# Altium project PCB-Tester-Board-V1.PrjPcb (part 1 of 3)
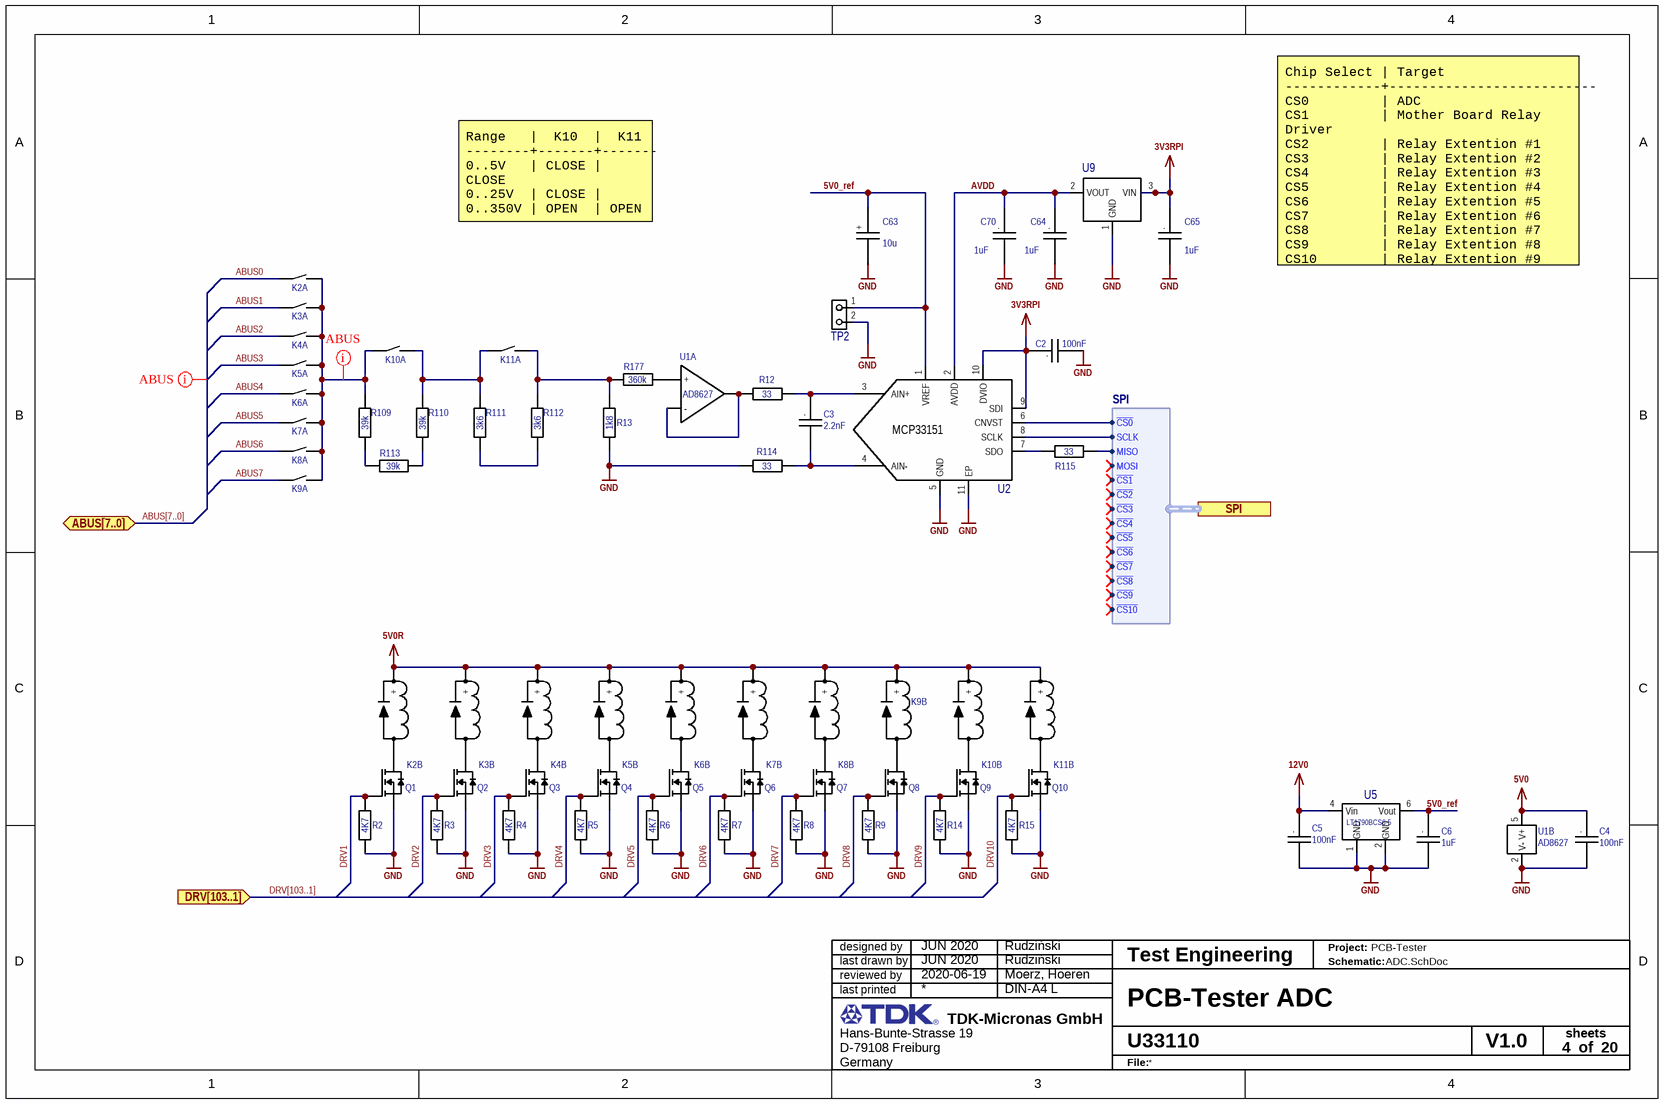
[diagram p0: ADC.SchDoc]
A_Number: A33003; Board: PCB-Tester-Board; BoardNumber: U33110; MajorRevision: 1; MinorRevision: 0; Project: PCB-Tester; Project_Name: PCB-Tester; Project_Number: U33110; Revision: 1.0; Team: Test Engineering; U_Number: U33110
10 sheets, 535 parts. Net scope: hierarchical (ports join the sheet entries above them; power ports are global).
Board file: PCB-Tester-Board-V1.PcbDoc
Sheets:
  ADC.SchDoc
  PowerRouting.SchDoc
  PSU1.SchDoc
  PSU2.SchDoc
  PSU3.SchDoc
  RelayDriver.SchDoc
  RelayExtension.SchDoc
  SignalRouting.SchDoc
  X7A15T-Decoupling.SchDoc
  AC-Cable.SchDoc

## Sheet ADC.SchDoc: PCB-Tester ADC
size A4; Date: JUN 2020; CheckedBy: Moerz, Hoeren; Author: Rudziński; CompanyName: TDK-Micronas GmbH; DrawnBy: Rudziński; Engineer: Rudziński; Organization: Test Engineering; Address1: Hans-Bunte-Strasse 19; Address2: D-79108 Freiburg; Address3: Germany; DocumentNumber: U33110; Revision: V1.0; SheetNumber: 4; SheetTotal: 20; DateDraw: JUN 2020; DateChecked: 2020-06-19; Workspace: Workspace; TitleTyp: Title-Typ; PageSetup: Record=PageOptions|CenterHorizontal=True|CenterVertical=True|PrintScale=0.97|XCorrection=1.00|YCorrection=1.00|PrintKind=0|BorderSize=5000000|LeftOffset=0|BottomOffset=0|Orientation=2|PaperLength=1000|PaperWidth=1000|Scale=100|PaperSource=7|PrintQuality=-3|MediaType=1|DitherType=10|PrintScaleMode=1|PaperKind=A4|PaperIndex=9

### Parts
C2  value 100nF  [C0402 Reflow]  (hidden comment: C)
C3  value 2.2nF  [C0603 Reflow]  (hidden comment: C)
C4  value 100nF  [C0402 Reflow]  (hidden comment: C)
C5  value 100nF  [C0402 Reflow]  (hidden comment: C)
C6  value 1uF  [C0402 Reflow]  (hidden comment: C)
C63  value 10u  [CAP_TAN_B]  (hidden comment: C+)
C64  value 1uF  [C0402 Reflow]  (hidden comment: C)
C65  value 1uF  [C0402 Reflow]  (hidden comment: C)
C70  value 1uF  [C0402 Reflow]  (hidden comment: C)
K2  K  [118-1A]  (value not drawn)  (parts A,B of 2)
K3  K  [118-1A]  (value not drawn)  (parts A,B of 2)
K4  K  [118-1A]  (value not drawn)  (parts A,B of 2)
K5  K  [118-1A]  (value not drawn)  (parts A,B of 2)
K6  K  [118-1A]  (value not drawn)  (parts A,B of 2)
K7  K  [118-1A]  (value not drawn)  (parts A,B of 2)
K8  K  [118-1A]  (value not drawn)  (parts A,B of 2)
K9  K  [118-1A]  (value not drawn)  (parts A,B of 2)
K10  K  [118-1A]  (value not drawn)  (parts A,B of 2)
K11  K  [118-1A]  (value not drawn)  (parts A,B of 2)
Q1  Q  [SOT23-3]  (value not drawn)
Q2  Q  [SOT23-3]  (value not drawn)
Q3  Q  [SOT23-3]  (value not drawn)
Q4  Q  [SOT23-3]  (value not drawn)
Q5  Q  [SOT23-3]  (value not drawn)
Q6  Q  [SOT23-3]  (value not drawn)
Q7  Q  [SOT23-3]  (value not drawn)
Q8  Q  [SOT23-3]  (value not drawn)
Q9  Q  [SOT23-3]  (value not drawn)
Q10  Q  [SOT23-3]  (value not drawn)
R2  value 4K7  [R0603 Reflow]  (hidden comment: R)
R3  value 4K7  [R0603 Reflow]  (hidden comment: R)
R4  value 4K7  [R0603 Reflow]  (hidden comment: R)
R5  value 4K7  [R0603 Reflow]  (hidden comment: R)
R6  value 4K7  [R0603 Reflow]  (hidden comment: R)
R7  value 4K7  [R0603 Reflow]  (hidden comment: R)
R8  value 4K7  [R0603 Reflow]  (hidden comment: R)
R9  value 4K7  [R0603 Reflow]  (hidden comment: R)
R12  value 33  [R0402 Reflow]  (hidden comment: R)
R13  value 1k8  [R0603 Reflow]  (hidden comment: R)
R14  value 4K7  [R0603 Reflow]  (hidden comment: R)
R15  value 4K7  [R0603 Reflow]  (hidden comment: R)
R109  value 39k  [R2512 Reflow]  (hidden comment: R)
R110  value 39k  [R2512 Reflow]  (hidden comment: R)
R111  value 3k6  [R0603 Reflow]  (hidden comment: R)
R112  value 3k6  [R0603 Reflow]  (hidden comment: R)
R113  value 39k  [R2512 Reflow]  (hidden comment: R)
R114  value 33  [R0402 Reflow]  (hidden comment: R)
R115  value 33  [R0402 Reflow]  (hidden comment: R)
R177  value 360k  [R1206 Reflow]  (hidden comment: R)
TP2  TP  [DualTestpoint 100mils]  (value not drawn)  (no BOM)
U1  U  [SC70-5]  (value not drawn)  (parts A,B of 2)
U2  NicName: MCP33151  [TDFN10EP]  (hidden comment: U)
U5  U  [TSOT23-6(S6)]  (value not drawn)
U9  U  [SOT23-3]  (value not drawn)

### Ports
ABUS[7..0] (bidir), DRV[103..1] (in), SPI (harness SPI)

### Harnesses
SPI: MISO, MOSI, SCLK, ~{CS0}, ~{CS1}, ~{CS2}, ~{CS3}, ~{CS4}, ~{CS5}, ~{CS6}, ~{CS7}, ~{CS8}, ~{CS9}, ~{CS10}

### Nets
3V3RPI: C2.1 C65.1 U2.9(SDI) U2.10(DVIO) U9.3(VIN)
5V0: C4.1 U1.5(V+)
5V0R: K2.1(+) K3.1(+) K4.1(+) K5.1(+) K6.1(+) K7.1(+) K8.1(+) K9.1(+) K10.1(+) K11.1(+)
12V0: C5.1 U5.4(Vin)
GND: C2.2 C4.2 C5.2 C6.2 C63.2 C64.2 C65.2 C70.2 Q1.2(S) Q2.2(S) Q3.2(S) Q4.2(S) Q5.2(S) Q6.2(S) Q7.2(S) Q8.2(S) Q9.2(S) Q10.2(S) R2.1 R3.1 R4.1 R5.1 R6.1 R7.1 R8.1 R9.1 R13.1 R14.1 R15.1 R114.2 TP2.2 U1.2(V-) U2.5(GND) U2.11(EP) U5.1(GND) U5.2(GND) U9.1(GND)
5V0_ref: C6.1 C63.1 TP2.1 U2.1(VREF) U5.6(Vout)  [project net 5V0_ref_4]
ABUS0: K2.4(CB)  [project net ABUS0_4]
ABUS1: K3.4(CB)  [project net ABUS1_4]
ABUS2: K4.4(CB)  [project net ABUS2_4]
ABUS3: K5.4(CB)  [project net ABUS3_4]
ABUS4: K6.4(CB)  [project net ABUS4_4]
ABUS5: K7.4(CB)  [project net ABUS5_4]
ABUS6: K8.4(CB)  [project net ABUS6_4]
ABUS7: K9.4(CB)  [project net ABUS7_4]
AVDD: C64.1 C70.1 U2.2(AVDD) U9.2(VOUT)  [project net AVDD_4]
DRV1: Q1.1(G) R2.2  [project net DRV1_4]
DRV2: Q2.1(G) R3.2  [project net DRV2_4]
DRV3: Q3.1(G) R4.2  [project net DRV3_4]
DRV4: Q4.1(G) R5.2  [project net DRV4_4]
DRV5: Q5.1(G) R6.2  [project net DRV5_4]
DRV6: Q6.1(G) R7.2  [project net DRV6_4]
DRV7: Q7.1(G) R8.2  [project net DRV7_4]
DRV8: Q8.1(G) R9.2  [project net DRV8_4]
DRV9: Q9.1(G) R14.2  [project net DRV9_4]
DRV10: Q10.1(G) R15.2  [project net DRV10_4]
NetC3_1: C3.1 R12.1 U2.3(AIN+)
NetC3_2: C3.2 R114.1 U2.4(AIN-)
NetK2_2: K2.2(-) Q1.3(D)
NetK2_3: K2.3(CA) K3.3(CA) K4.3(CA) K5.3(CA) K6.3(CA) K7.3(CA) K8.3(CA) K9.3(CA) K10.4(CB) R109.2
NetK3_2: K3.2(-) Q2.3(D)
NetK4_2: K4.2(-) Q3.3(D)
NetK5_2: K5.2(-) Q4.3(D)
NetK6_2: K6.2(-) Q5.3(D)
NetK7_2: K7.2(-) Q6.3(D)
NetK8_2: K8.2(-) Q7.3(D)
NetK9_2: K9.2(-) Q8.3(D)
NetK10_2: K10.2(-) Q9.3(D)
NetK10_3: K10.3(CA) K11.4(CB) R110.2 R111.2
NetK11_2: K11.2(-) Q10.3(D)
NetK11_3: K11.3(CA) R13.2 R112.2 R177.2
NetR12_2: R12.2 U1.1(Out) U1.4(-)
NetR109_1: R109.1 R113.2
NetR110_1: R110.1 R113.1
NetR111_1: R111.1 R112.1
NetR115_1: R115.1 U2.7(SDO)
NetR115_2: R115.2 ; port SPI.MISO
NetR177_1: R177.1 U1.3(+)
NetU2_6: U2.6(CNVST) ; port SPI.~{CS0}
NetU2_8: U2.8(SCLK) ; port SPI.SCLK

### Buses and harness runs
bus ABUS[7..0] = port ABUS[7..0]
bus DRV[103..1] = port DRV[103..1]

### Layout directives
net class ABUS: (no net found under the mark), NetK2_3

### Notes on the sheet
- Range   |  K10  |  K11
  --------+-------+-------
  0..5V   | CLOSE | CLOSE
  0..25V  | CLOSE |
  0..350V | OPEN  | OPEN
- Chip Select | Target
  ------------+--------------------------
  CS0         | ADC
  CS1         | Mother Board Relay Driver
  CS2         | Relay Extention #1
  CS3         | Relay Extention #2
  CS4         | Relay Extention #3
  CS5         | Relay Extention #4
  CS6         | Relay Extention #5
  CS7         | Relay Extention #6
  CS8         | Relay Extention #7
  CS9         | Relay Extention #8
  CS10        | Relay Extention #9
- designed by
- reviewed by
- last drawn by
- Project:
- Schematic:
- last printed
- DIN-A4 L
- sheets
- of
- File:
- (in symbol C) .
- (in symbol C+_TAN) +

### Library data of the parts
C2 C4 C5 = C: CAP CER 0.1UF 25V X7R 0402; 04. Manufacturer: Yageo; 07. Manufacturer  Part Number: CC0402KRX7R8BB104; Tolerance: ±5%; Voltage Rating: 16V; 03. Unit Price: 0.09; 13. Created Date/Name: AUG2018/Hören; Type: X7R; ComponentLink1Description: Info; ComponentLink1URL: https://www.digikey.de/product-detail/en/kemet/C0402C104J4RACTU/399-7761-6-ND/3472292; 02. Distributor Part Number: 311-2077-6-ND; 09. Operating Temperature: -55°C ~ 125°C; 11. RoHS: YES; 01. Distributor: DigiKey; ComponentLink2Description: DataSheet; ComponentLink2URL: https://content.kemet.com/datasheets/KEM_C1002_X7R_SMD.pdf; Package: 0402
C3 = C: CAP CER 2200PF 50V X7R 0402; 04. Manufacturer: Samsung Electro-Mechanics; 07. Manufacturer  Part Number: CL05B222JB5NNNC; Tolerance: ±5%; 03. Unit Price: 0.09; 13. Created Date/Name: AUG2018/Hören; Voltage Rating: 50V; Type: X7R; ComponentLink1Description: Info; ComponentLink1URL: https://www.digikey.de/product-detail/en/samsung-electro-mechanics/CL05B222JB5NNNC/1276-1532-6-ND/3892046; 02. Distributor Part Number: 1276-1532-6-ND; 09. Operating Temperature: -55°C ~ 125°C; 11. RoHS: YES; 01. Distributor: DigiKey; ComponentLink2Description: DataSheet; Package: 0402
C6 C64 C65 C70 = C: CAP CER 1UF 6.3V X7R 0402; 04. Manufacturer: Murata Electronics; 07. Manufacturer  Part Number: GRM155R70J105KA12J; Tolerance: ±10%; 03. Unit Price: 0.11; 13. Created Date/Name: AUG2018/Hören; Voltage Rating: 6.3V; Type: X7R; ComponentLink1Description: Info; ComponentLink1URL: https://www.digikey.de/product-detail/en/murata-electronics/GRM155R70J105KA12J/490-13339-6-ND/5973468; 02. Distributor Part Number: 490-13339-6-ND; 09. Operating Temperature: -55°C ~ 125°C; 11. RoHS: YES; 01. Distributor: DigiKey; ComponentLink2Description: DataSheet; Package: 0402
C63 = C+_TAN: CAP TANT 10UF 20% 16V 1411; 04. Manufacturer: Vishay Sprague; 07. Manufacturer  Part Number: TMCHB1C106MTRF; 03. Unit Price: 0.4; 3D-Export: No; ComponentLink1Description: Info; 02. Distributor Part Number: 718-2344-1-ND; 11. RoHS: YES; 01. Distributor: DigiKey; ComponentLink2Description: DataSheet
K2-K11 = 118-1-A-5/2D: 5V Signal Relais, Normal Open; 04. Manufacturer: Pickering; 03. Unit Price: 2.60; 05. Quantity: 1000; 06. Data Sheet: Pickering_series_118.pdf; 13. Created Date/Name: 20.12.17 S. Kaiser; Coil Resistance: 1500 Ohm; Max Carry Current: 1.2 A; Max Switch Current: 1A; Max Switch Voltage: 200V; Power Rating: 15W; 01. Distributor: Pickering; 02. Distributor Part Number: 118-1-A-5/2D; 07. Manufacturer  Part Number: 118-1-A-5/2D; 09. Operating Temperature: -20°C ~ +85°C; 11. RoHS: 2011/65/EU; ComponentLink1Description: Info; ComponentLink1URL: http://www.pickeringrelay.com/; ComponentLink2Description: DataSheet; ComponentLink2URL: https://www.pickeringrelay.com/products/single-line-sil-series-111-119/single-line-sil-series-118/; Coil Voltage: 5V
Q1-Q10 = FDV303N: MOSFET N-CH 25V 680MA SOT-23; 04. Manufacturer: ON Semiconductor; 03. Unit Price: 0.41; 13. Created Date/Name: AUG 2018 / Hören; Rds On: 450 mΩ @ id=500mA & Vgs=4.5V; Vgs,th: 1.5V @ 250uA; Power Rating: 350mW; 3D-Export: No; 01. Distributor: DigiKey; 02. Distributor Part Number: FDV303NDKR-ND; 07. Manufacturer  Part Number: FDV303N; 09. Operating Temperature: -55°C ~ 150°C (TJ); 11. RoHS: YES; ComponentLink1Description: Info; ComponentLink1URL: https://www.digikey.de/product-detail/en/on-semiconductor/FDV303N/FDV303NDKR-ND/1630434; ComponentLink2Description: DataSheet; ComponentLink2URL: https://media.digikey.com/pdf/Data%20Sheets/Fairchild%20PDFs/FDV303N.pdf; Vdss: 25V; Id: 680mA
R2-R9 R14 R15 = R: RES SMD 4.7K OHM 1% 1/10W 0603; 04. Manufacturer: Yageo; 07. Manufacturer  Part Number: RC0603FR-074K7L; 03. Unit Price: 0.09; 13. Created Date/Name: AUG2018/Hören; Tolerance: ±1%; ComponentLink1URL: *; ComponentLink1Description: Info; 02. Distributor Part Number: 311-4.70KHRCT-ND; 09. Operating Temperature: -xx..+yy°C; 11. RoHS: ???; 01. Distributor: DigiKey; ComponentLink2Description: DataSheet; Package: *
R12 R114 = R: RES SMD 33 OHM 1% 1/16W 0402; 04. Manufacturer: Yageo; 07. Manufacturer  Part Number: RC0402FR-0733RL; 03. Unit Price: 0.09; 13. Created Date/Name: AUG2018/Hören; Power Rating: 0.1W; Tolerance: ±1%; ComponentLink1URL: https://www.digikey.de/product-detail/en/panasonic-electronic-components/ERJ-2RKF15R0X/P15.0LDKR-ND/575530; ComponentLink1Description: Info; 02. Distributor Part Number: 311-33.0LRDKR-ND; 09. Operating Temperature: -55°C ~ 155°C; 11. RoHS: YES; 01. Distributor: DigiKey; ComponentLink2Description: DataSheet; ComponentLink2URL: https://industrial.panasonic.com/cdbs/www-data/pdf/RDA0000/AOA0000C304.pdf; Type: Thick Film; Package: 0402
R13 = R: RES SMD 1.8K OHM 1% 1/16W 0402; 04. Manufacturer: Yageo; 07. Manufacturer  Part Number: RC0402FR-071K8L; 03. Unit Price: 0.09; 13. Created Date/Name: AUG2018/Hören; Tolerance: ±1%; ComponentLink1URL: *; ComponentLink1Description: Info; 02. Distributor Part Number: 311-1.80KLRCT-ND; 09. Operating Temperature: -xx..+yy°C; 11. RoHS: ???; 01. Distributor: DigiKey; ComponentLink2Description: DataSheet; Package: *
R109 R110 R113 = R: CRGP 2512 39K 1%; 04. Manufacturer: TE Connectivity Passive Product; 07. Manufacturer  Part Number: CRGP2512F39K; 03. Unit Price: 0.44; 13. Created Date/Name: AUG2018/Hören; Tolerance: ±1%; ComponentLink1URL: *; ComponentLink1Description: Info; 02. Distributor Part Number: A130740CT-ND; 09. Operating Temperature: -xx..+yy°C; 11. RoHS: ???; 01. Distributor: DigiKey; ComponentLink2Description: DataSheet; Package: *
R111 R112 = R: RES SMD 3.6K OHM 1% 1/10W 0603; 04. Manufacturer: Yageo; 07. Manufacturer  Part Number: RC0603FR-073K6L; 03. Unit Price: 0.09; 13. Created Date/Name: AUG2018/Hören; Tolerance: ±1%; ComponentLink1URL: *; ComponentLink1Description: Info; 02. Distributor Part Number: 311-3.60KHRCT-ND; 09. Operating Temperature: -xx..+yy°C; 11. RoHS: ???; 01. Distributor: DigiKey; ComponentLink2Description: DataSheet; Package: *
R115 = R_19: RES SMD 33 OHM 1% 1/16W 0402; 04. Manufacturer: Yageo; 07. Manufacturer  Part Number: RC0402FR-0733RL; 03. Unit Price: 0.09; 13. Created Date/Name: AUG2018/Hören; Power Rating: 63mW; Tolerance: ±1%; ComponentLink1URL: https://www.digikey.de/products/en?keywords=311-33.0LRDKR-ND; ComponentLink1Description: Info; 02. Distributor Part Number: 311-33.0LRDKR-ND; 09. Operating Temperature: -55°C ~ 155°C; 11. RoHS: YES; 01. Distributor: DigiKey; ComponentLink2Description: DataSheet; Type: Thick Film; Package: 0402
R177 = R: RES SMD 360K OHM 1% 1/4W 1206; 04. Manufacturer: Yageo; 07. Manufacturer  Part Number: RC1206FR-07360KL; 03. Unit Price: 0.09; 13. Created Date/Name: AUG2018/Hören; Tolerance: ±1%; ComponentLink1URL: *; ComponentLink1Description: Info; 02. Distributor Part Number: 311-360KFRCT-ND; 09. Operating Temperature: -xx..+yy°C; 11. RoHS: ???; 01. Distributor: DigiKey; ComponentLink2Description: DataSheet; Package: *
TP2 = DualTestpoint 100mils: Dual testpoint, pitch 2.54mm; 04. Manufacturer: Samtec Inc.; 07. Manufacturer  Part Number: HMTSW-103-07-G-S-240; 03. Unit Price: 0.25; 13. Created Date/Name: AUG2018/Hören; 01. Distributor: Samtec Inc.; 02. Distributor Part Number: HMTSW-103-07-G-S-240; 11. RoHS: YES; ComponentLink1Description: Info; ComponentLink1URL: https://www.samtec.com/products/hmtsw-103-07-g-s-240; ComponentLink2Description: DataSheet; ComponentLink2URL: http://suddendocs.samtec.com/catalog_english/hmtsw.pdf
U1 = AD8627: IC OPAMP JFET 5MHZ RRO SC70-5; 04. Manufacturer: Analog Devices Inc.; 07. Manufacturer  Part Number: AD8627AKSZ-R2; 03. Unit Price: 5.15; 13. Created Date/Name: AUG 2018 / Hören; 01. Distributor: DigiKey; 02. Distributor Part Number: AD8627AKSZ-R2DKR-ND; 09. Operating Temperature: -40°C ~ 85°C; 11. RoHS: YES; ComponentLink1Description: Info; ComponentLink1URL: https://www.digikey.de/product-detail/en/analog-devices-inc/AD8627AKSZ-R2/AD8627AKSZ-R2DKR-ND/3878640; ComponentLink2Description: DataSheet; ComponentLink2URL: http://www.analog.com/media/en/technical-documentation/data-sheets/AD8625_8626_8627.pdf; Package: SC70-5; Part: AD8627
U2 = MCP33151-10T-E/MN: 14-BIT 1 MSPS SGL CH SGL-ENDED S; 04. Manufacturer: Microchip Technology; 03. Unit Price: 4.5; 13. Created Date/Name: AUG 2018 / Hören; 01. Distributor: DigiKey; 02. Distributor Part Number: MCP33151-10T-E/MNDKR-ND; 07. Manufacturer  Part Number: MCP33151-10T-E/MN; 11. RoHS: YES; ComponentLink1Description: Info; ComponentLink1URL: https://www.digikey.de/product-detail/en/microchip-technology/MCP33151-10T-E-MN/MCP33151-10T-E-MNDKR-ND/10270414; ComponentLink2Description: DataSheet; ComponentLink2URL: http://ww1.microchip.com/downloads/en/DeviceDoc/MCP33151-XX-Family-Data-Sheet-DS20006220A.pdf; Package: 10-WFDFN Exposed Pad
U5 = LT1790BCS6-5: IC VREF SERIES 5V, 0.1% TSOT-23-6; 04. Manufacturer: Linear Technology/Analog Devices; 07. Manufacturer  Part Number: LT1790BCS6-5#TRMPBF; 03. Unit Price: 2.86; 13. Created Date/Name: AUG 2018 / Hören; 01. Distributor: DigiKey; 02. Distributor Part Number: LT1790BCS6-5#TRMPBFDKR-ND; 09. Operating Temperature: 0°C ~ 70°C (TA); 11. RoHS: YES; ComponentLink1Description: Info; ComponentLink1URL: https://www.digikey.de/product-detail/en/linear-technology-analog-devices/LT1790BCS6-5-TRMPBF/LT1790BCS6-5-TRMPBFDKR-ND/1618066; ComponentLink2Description: DataSheet; ComponentLink2URL: https://www.analog.com/media/en/technical-documentation/data-sheets/1790fc.pdf; NicName: LT1790BCS6-5
U9 = AP2138N: IC REG LINEAR 1.8V 250MA SOT23-3; 04. Manufacturer: Diodes Incorporated; 07. Manufacturer  Part Number: AP2138N-1.8TRG1; 03. Unit Price: 0.43; 01. Distributor: DigiKey; 02. Distributor Part Number: AP2138N-1.8TRG1DICT-ND; 11. RoHS: YES; ComponentLink1Description: Info; ComponentLink2Description: DataSheet

## Sheet PowerRouting.SchDoc: PCB-Tester Power Routing
size A4; Date: JUN 2020; CheckedBy: Moerz, Hoeren; Author: Rudziński; CompanyName: TDK-Micronas GmbH; DrawnBy: Rudziński; Engineer: Rudziński; Organization: Test Engineering; Address1: Hans-Bunte-Strasse 19; Address2: D-79108 Freiburg; Address3: Germany; DocumentNumber: U33110; Revision: V1.0; SheetNumber: 18; SheetTotal: 20; DateDraw: JUN 2020; DateChecked: 2020-06-19; Workspace: Workspace; TitleTyp: Title-Typ; PageSetup: Record=PageOptions|CenterHorizontal=True|CenterVertical=True|PrintScale=0.97|XCorrection=1.00|YCorrection=1.00|PrintKind=0|BorderSize=5000000|LeftOffset=0|BottomOffset=0|Orientation=2|PaperLength=1000|PaperWidth=1000|Scale=100|PaperSource=7|PrintQuality=-3|MediaType=1|DitherType=10|PrintScaleMode=1|PaperKind=A4|PaperIndex=9
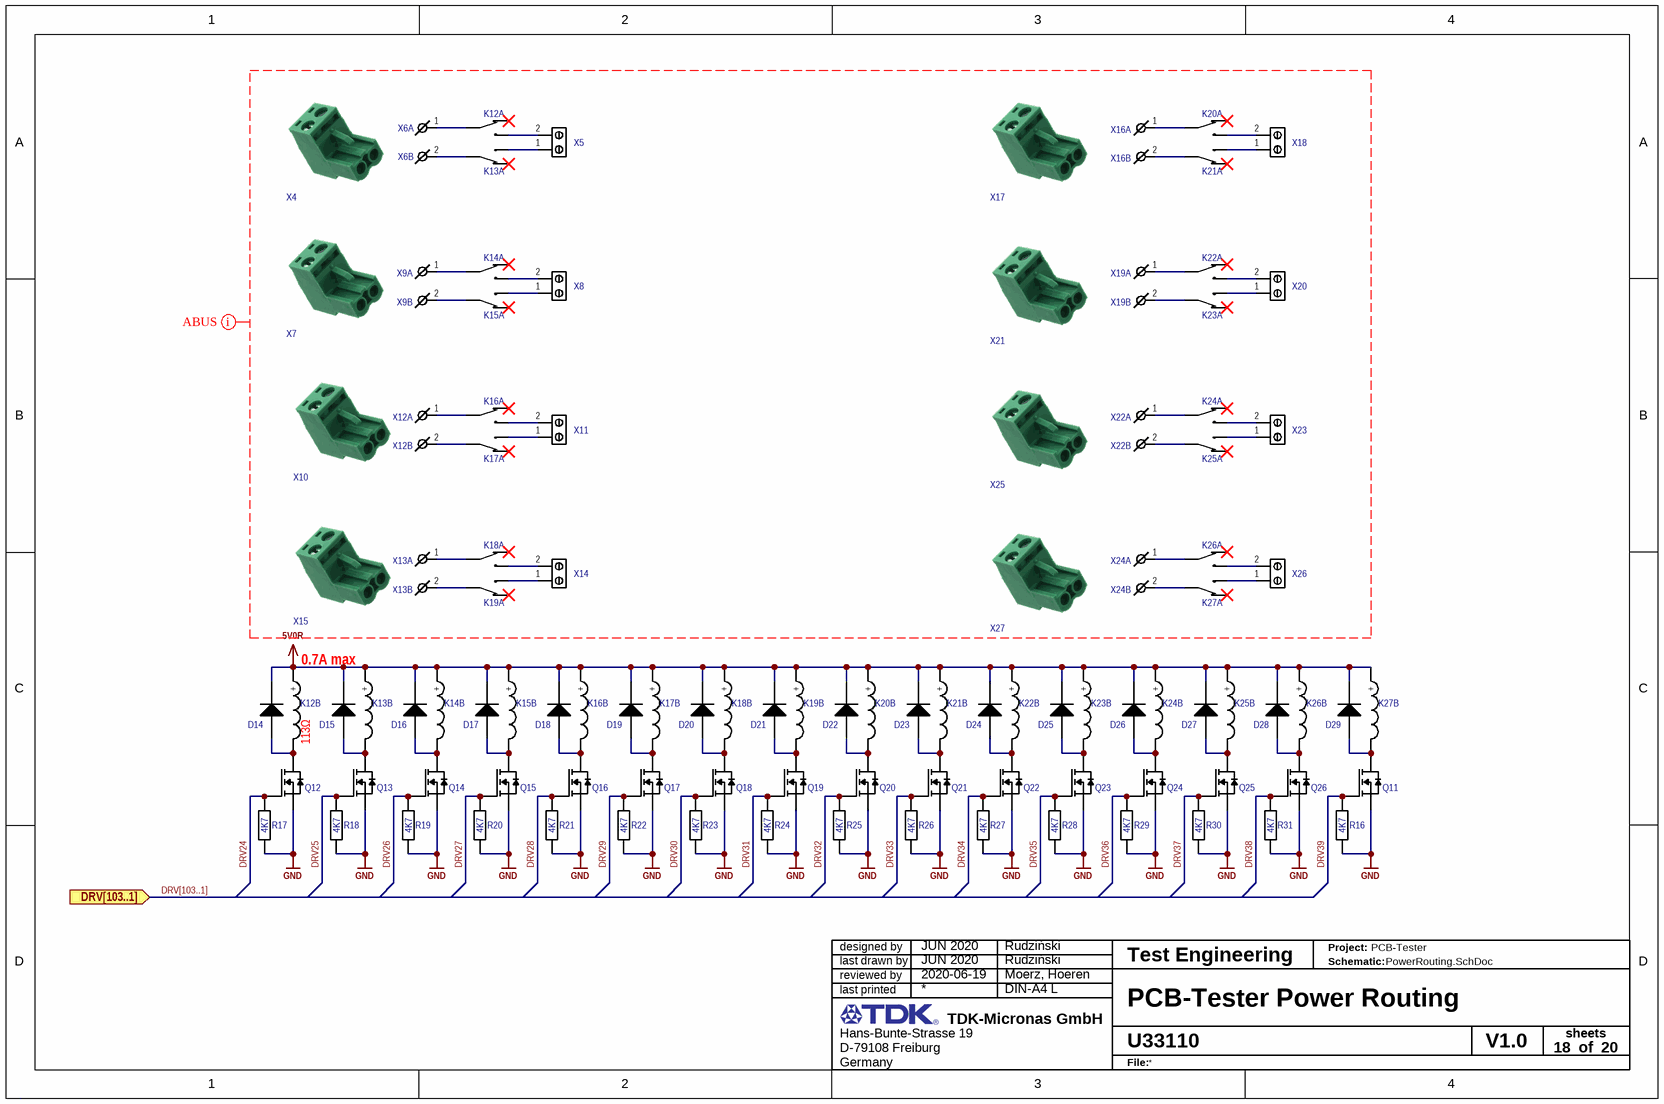
[diagram p1: PowerRouting.SchDoc]

### Parts
D14  D  [SOD123]  (value not drawn)
D15  D  [SOD123]  (value not drawn)
D16  D  [SOD123]  (value not drawn)
D17  D  [SOD123]  (value not drawn)
D18  D  [SOD123]  (value not drawn)
D19  D  [SOD123]  (value not drawn)
D20  D  [SOD123]  (value not drawn)
D21  D  [SOD123]  (value not drawn)
D22  D  [SOD123]  (value not drawn)
D23  D  [SOD123]  (value not drawn)
D24  D  [SOD123]  (value not drawn)
D25  D  [SOD123]  (value not drawn)
D26  D  [SOD123]  (value not drawn)
D27  D  [SOD123]  (value not drawn)
D28  D  [SOD123]  (value not drawn)
D29  D  [SOD123]  (value not drawn)
K12  K  [HF118F005-1ZS1]  (value not drawn)  (parts A,B of 2)
K13  K  [HF118F005-1ZS1]  (value not drawn)  (parts A,B of 2)
K14  K  [HF118F005-1ZS1]  (value not drawn)  (parts A,B of 2)
K15  K  [HF118F005-1ZS1]  (value not drawn)  (parts A,B of 2)
K16  K  [HF118F005-1ZS1]  (value not drawn)  (parts A,B of 2)
K17  K  [HF118F005-1ZS1]  (value not drawn)  (parts A,B of 2)
K18  K  [HF118F005-1ZS1]  (value not drawn)  (parts A,B of 2)
K19  K  [HF118F005-1ZS1]  (value not drawn)  (parts A,B of 2)
K20  K  [HF118F005-1ZS1]  (value not drawn)  (parts A,B of 2)
K21  K  [HF118F005-1ZS1]  (value not drawn)  (parts A,B of 2)
K22  K  [HF118F005-1ZS1]  (value not drawn)  (parts A,B of 2)
K23  K  [HF118F005-1ZS1]  (value not drawn)  (parts A,B of 2)
K24  K  [HF118F005-1ZS1]  (value not drawn)  (parts A,B of 2)
K25  K  [HF118F005-1ZS1]  (value not drawn)  (parts A,B of 2)
K26  K  [HF118F005-1ZS1]  (value not drawn)  (parts A,B of 2)
K27  K  [HF118F005-1ZS1]  (value not drawn)  (parts A,B of 2)
Q11  Q  [SOT23-3]  (value not drawn)
Q12  Q  [SOT23-3]  (value not drawn)
Q13  Q  [SOT23-3]  (value not drawn)
Q14  Q  [SOT23-3]  (value not drawn)
Q15  Q  [SOT23-3]  (value not drawn)
Q16  Q  [SOT23-3]  (value not drawn)
Q17  Q  [SOT23-3]  (value not drawn)
Q18  Q  [SOT23-3]  (value not drawn)
Q19  Q  [SOT23-3]  (value not drawn)
Q20  Q  [SOT23-3]  (value not drawn)
Q21  Q  [SOT23-3]  (value not drawn)
Q22  Q  [SOT23-3]  (value not drawn)
Q23  Q  [SOT23-3]  (value not drawn)
Q24  Q  [SOT23-3]  (value not drawn)
Q25  Q  [SOT23-3]  (value not drawn)
Q26  Q  [SOT23-3]  (value not drawn)
R16  value 4K7  [R0603 Reflow]  (hidden comment: R)
R17  value 4K7  [R0603 Reflow]  (hidden comment: R)
R18  value 4K7  [R0603 Reflow]  (hidden comment: R)
R19  value 4K7  [R0603 Reflow]  (hidden comment: R)
R20  value 4K7  [R0603 Reflow]  (hidden comment: R)
R21  value 4K7  [R0603 Reflow]  (hidden comment: R)
R22  value 4K7  [R0603 Reflow]  (hidden comment: R)
R23  value 4K7  [R0603 Reflow]  (hidden comment: R)
R24  value 4K7  [R0603 Reflow]  (hidden comment: R)
R25  value 4K7  [R0603 Reflow]  (hidden comment: R)
R26  value 4K7  [R0603 Reflow]  (hidden comment: R)
R27  value 4K7  [R0603 Reflow]  (hidden comment: R)
R28  value 4K7  [R0603 Reflow]  (hidden comment: R)
R29  value 4K7  [R0603 Reflow]  (hidden comment: R)
R30  value 4K7  [R0603 Reflow]  (hidden comment: R)
R31  value 4K7  [R0603 Reflow]  (hidden comment: R)
X4  X  [691352710002]  (value not drawn)
X5  X  [1731721]  (value not drawn)
X6  X  [691312710002]  (value not drawn)  (parts A,B of 2)
X7  X  [691352710002]  (value not drawn)
X8  X  [1731721]  (value not drawn)
X9  X  [691312710002]  (value not drawn)  (parts A,B of 2)
X10  X  [691352710002]  (value not drawn)
X11  X  [1731721]  (value not drawn)
X12  X  [691312710002]  (value not drawn)  (parts A,B of 2)
X13  X  [691312710002]  (value not drawn)  (parts A,B of 2)
X14  X  [1731721]  (value not drawn)
X15  X  [691352710002]  (value not drawn)
X16  X  [691312710002]  (value not drawn)  (parts A,B of 2)
X17  X  [691352710002]  (value not drawn)
X18  X  [1731721]  (value not drawn)
X19  X  [691312710002]  (value not drawn)  (parts A,B of 2)
X20  X  [1731721]  (value not drawn)
X21  X  [691352710002]  (value not drawn)
X22  X  [691312710002]  (value not drawn)  (parts A,B of 2)
X23  X  [1731721]  (value not drawn)
X24  X  [691312710002]  (value not drawn)  (parts A,B of 2)
X25  X  [691352710002]  (value not drawn)
X26  X  [1731721]  (value not drawn)
X27  X  [691352710002]  (value not drawn)

### Ports
DRV[103..1] (in)

### Nets
5V0R: D14.2(C) D15.2(C) D16.2(C) D17.2(C) D18.2(C) D19.2(C) D20.2(C) D21.2(C) D22.2(C) D23.2(C) D24.2(C) D25.2(C) D26.2(C) D27.2(C) D28.2(C) D29.2(C) K12.1(+) K13.1(+) K14.1(+) K15.1(+) K16.1(+) K17.1(+) K18.1(+) K19.1(+) K20.1(+) K21.1(+) K22.1(+) K23.1(+) K24.1(+) K25.1(+) K26.1(+) K27.1(+)
GND: Q11.2(S) Q12.2(S) Q13.2(S) Q14.2(S) Q15.2(S) Q16.2(S) Q17.2(S) Q18.2(S) Q19.2(S) Q20.2(S) Q21.2(S) Q22.2(S) Q23.2(S) Q24.2(S) Q25.2(S) Q26.2(S) R16.1 R17.1 R18.1 R19.1 R20.1 R21.1 R22.1 R23.1 R24.1 R25.1 R26.1 R27.1 R28.1 R29.1 R30.1 R31.1
DRV24: Q12.1(G) R17.2  [project net DRV24_18]
DRV25: Q13.1(G) R18.2  [project net DRV25_18]
DRV26: Q14.1(G) R19.2  [project net DRV26_18]
DRV27: Q15.1(G) R20.2  [project net DRV27_18]
DRV28: Q16.1(G) R21.2  [project net DRV28_18]
DRV29: Q17.1(G) R22.2  [project net DRV29_18]
DRV30: Q18.1(G) R23.2  [project net DRV30_18]
DRV31: Q19.1(G) R24.2  [project net DRV31_18]
DRV32: Q20.1(G) R25.2  [project net DRV32_18]
DRV33: Q21.1(G) R26.2  [project net DRV33_18]
DRV34: Q22.1(G) R27.2  [project net DRV34_18]
DRV35: Q23.1(G) R28.2  [project net DRV35_18]
DRV36: Q24.1(G) R29.2  [project net DRV36_18]
DRV37: Q25.1(G) R30.2  [project net DRV37_18]
DRV38: Q26.1(G) R31.2  [project net DRV38_18]
DRV39: Q11.1(G) R16.2  [project net DRV39_18]
NetD14_1: D14.1(A) K12.5(-) Q12.3(D)
NetD15_1: D15.1(A) K13.5(-) Q13.3(D)
NetD16_1: D16.1(A) K14.5(-) Q14.3(D)
NetD17_1: D17.1(A) K15.5(-) Q15.3(D)
NetD18_1: D18.1(A) K16.5(-) Q16.3(D)
NetD19_1: D19.1(A) K17.5(-) Q17.3(D)
NetD20_1: D20.1(A) K18.5(-) Q18.3(D)
NetD21_1: D21.1(A) K19.5(-) Q19.3(D)
NetD22_1: D22.1(A) K20.5(-) Q20.3(D)
NetD23_1: D23.1(A) K21.5(-) Q21.3(D)
NetD24_1: D24.1(A) K22.5(-) Q22.3(D)
NetD25_1: D25.1(A) K23.5(-) Q23.3(D)
NetD26_1: D26.1(A) K24.5(-) Q24.3(D)
NetD27_1: D27.1(A) K25.5(-) Q25.3(D)
NetD28_1: D28.1(A) K26.5(-) Q26.3(D)
NetD29_1: D29.1(A) K27.5(-) Q11.3(D)
NetK12_2: K12.2(Cin) X6.1(+)
NetK12_3: K12.3(Cno) X5.2
NetK13_2: K13.2(Cin) X6.2(-)
NetK13_3: K13.3(Cno) X5.1
NetK14_2: K14.2(Cin) X9.1(+)
NetK14_3: K14.3(Cno) X8.2
NetK15_2: K15.2(Cin) X9.2(-)
NetK15_3: K15.3(Cno) X8.1
NetK16_2: K16.2(Cin) X12.1(+)
NetK16_3: K16.3(Cno) X11.2
NetK17_2: K17.2(Cin) X12.2(-)
NetK17_3: K17.3(Cno) X11.1
NetK18_2: K18.2(Cin) X13.1(+)
NetK18_3: K18.3(Cno) X14.2
NetK19_2: K19.2(Cin) X13.2(-)
NetK19_3: K19.3(Cno) X14.1
NetK20_2: K20.2(Cin) X16.1(+)
NetK20_3: K20.3(Cno) X18.2
NetK21_2: K21.2(Cin) X16.2(-)
NetK21_3: K21.3(Cno) X18.1
NetK22_2: K22.2(Cin) X19.1(+)
NetK22_3: K22.3(Cno) X20.2
NetK23_2: K23.2(Cin) X19.2(-)
NetK23_3: K23.3(Cno) X20.1
NetK24_2: K24.2(Cin) X22.1(+)
NetK24_3: K24.3(Cno) X23.2
NetK25_2: K25.2(Cin) X22.2(-)
NetK25_3: K25.3(Cno) X23.1
NetK26_2: K26.2(Cin) X24.1(+)
NetK26_3: K26.3(Cno) X26.2
NetK27_2: K27.2(Cin) X24.2(-)
NetK27_3: K27.3(Cno) X26.1

Not connected (* = marked no-connect by the designer): K12 4(Cnc)*; K13 4(Cnc)*; K14 4(Cnc)*; K15 4(Cnc)*; K16 4(Cnc)*; K17 4(Cnc)*; K18 4(Cnc)*; K19 4(Cnc)*; K20 4(Cnc)*; K21 4(Cnc)*; K22 4(Cnc)*; K23 4(Cnc)*; K24 4(Cnc)*; K25 4(Cnc)*; K26 4(Cnc)*; K27 4(Cnc)*

### Buses and harness runs
bus DRV[103..1] = port DRV[103..1]

### Layout directives
net class ABUS: (no net found under the mark)

### Notes on the sheet
- 0.7A max
- designed by
- reviewed by
- last drawn by
- Project:
- Schematic:
- last printed
- DIN-A4 L
- sheets
- of
- File:

### Library data of the parts
D14-D29 = 1N4148W: DIODE GEN PURP 100V 300MA SOD123; 04. Manufacturer: Diodes Incorporated; 07. Manufacturer  Part Number: 1N4148W-7-F; 03. Unit Price: 0.14; 01. Distributor: DigiKey; 02. Distributor Part Number: 1N4148W-FDICT-ND; 11. RoHS: YES; ComponentLink1Description: Info; ComponentLink1URL: https://www.digikey.de/product-detail/en/nexperia-usa-inc/PMEG4050EP115/1727-5842-6-ND/2697559; ComponentLink2Description: DataSheet; ComponentLink2URL: https://assets.nexperia.com/documents/data-sheet/PMEG4050EP.pdf
K12-K27 = HF118F005-1ZS1: 5V Power Relay, switch over; 04. Manufacturer: Hongfa Europe GMBH; 07. Manufacturer  Part Number: HF118F/005-1ZS1T(136); 03. Unit Price: 2.60; 13. Created Date/Name: AUG2018/Hören; Coil Resistance: 113Ω; Max Carry Current: 10A; Max Switch Voltage: 440Vac/125Vdc; Power Rating: 300Wdc/2.5KVAac; 01. Distributor: RS-Components; 02. Distributor Part Number: 176-2821; 09. Operating Temperature: -xx..+yy°C; 11. RoHS: YES; ComponentLink1Description: Info; ComponentLink1URL: https://de.rs-online.com/web/p/monostabile-relais/1762821/; ComponentLink2Description: DataSheet; ComponentLink2URL: https://docs.rs-online.com/c37d/0900766b81663e9a.pdf; Coil Voltage: 5V; Max Switch Current: 10A
Q11-Q26 = FDV303N: as Q1 on sheet ADC; 01. Distributor: DigiKey; 02. Distributor Part Number: FDV303NDKR-ND; 07. Manufacturer  Part Number: FDV303N; 09. Operating Temperature: -55°C ~ 150°C (TJ); 11. RoHS: YES; ComponentLink1Description: Info; ComponentLink1URL: https://www.digikey.de/product-detail/en/on-semiconductor/FDV303N/FDV303NDKR-ND/1630434; ComponentLink2Description: DataSheet; ComponentLink2URL: https://media.digikey.com/pdf/Data%20Sheets/Fairchild%20PDFs/FDV303N.pdf; Vdss: 25V; Id: 680mA
R16-R31 = R: as R2 on sheet ADC; Tolerance: ±1%; ComponentLink1URL: *; ComponentLink1Description: Info; 02. Distributor Part Number: 311-4.70KHRCT-ND; 09. Operating Temperature: -xx..+yy°C; 11. RoHS: ???; 01. Distributor: DigiKey; ComponentLink2Description: DataSheet; Package: *
X4 X7 X10 X15 X17 X21 X25 X27 = 691352710002: TERM BLOCK PLUG 2POS STR 5MM; 04. Manufacturer: Würth Elektronik; 03. Unit Price: 1.1; 13. Created Date/Name: ??? / Hören; System: Connector; 01. Distributor: DigiKey; 02. Distributor Part Number: 732-2775-ND; 07. Manufacturer  Part Number: 691352710002; ComponentLink1Description: Info; ComponentLink1URL: https://www.digikey.de/products/en?keywords=691352710002; ComponentLink2Description: DataSheet; ComponentLink2URL: https://www.we-online.de/katalog/datasheet/6913527100xx.pdf
X5 X8 X11 X14 X18 X20 X23 X26 = 1731721: TERM BLK 2P SIDE ENT 7.62MM PCB; 04. Manufacturer: Phoenix Contact; 03. Unit Price: 2.12; 13. Created Date/Name: JAN 2019 / Hören; System: Connector; 01. Distributor: DigiKey; 02. Distributor Part Number: 277-5849-ND; 07. Manufacturer  Part Number: 1731721; 11. RoHS: YES; ComponentLink1Description: Info; ComponentLink1URL: https://www.digikey.de/products/en?keywords=1731721; ComponentLink2Description: DataSheet; ComponentLink2URL: https://media.digikey.com/pdf/Data%20Sheets/Phoenix%20Contact%20PDFs/1731721.pdf
X6 X9 X12 X13 X16 X19 X22 X24 = 691312710002: TERM BLOCK HDR 2POS 90DEG 5MM; 04. Manufacturer: Würth Elektronik; 03. Unit Price: 0.244; 13. Created Date/Name: ??? / Hören; System: Connector; 01. Distributor: DigiKey; 02. Distributor Part Number: 732-2805-ND; 07. Manufacturer  Part Number: 691312710002; ComponentLink1Description: Info; ComponentLink2Description: DataSheet

## Sheet PSU1.SchDoc: PCB-Tester PSU1
size A4; Date: JUN 2020; CheckedBy: Moerz, Hoeren; Author: Rudziński; CompanyName: TDK-Micronas GmbH; DrawnBy: Rudziński; Engineer: Rudziński; Organization: Test Engineering; Address1: Hans-Bunte-Strasse 19; Address2: D-79108 Freiburg; Address3: Germany; DocumentNumber: U33110; Revision: V1.0; SheetNumber: 15; SheetTotal: 20; DateDraw: JUN 2020; DateChecked: 2020-06-19; Workspace: Workspace; TitleTyp: Title-Typ; PageSetup: Record=PageOptions|CenterHorizontal=True|CenterVertical=True|PrintScale=0.97|XCorrection=1.00|YCorrection=1.00|PrintKind=0|BorderSize=5000000|LeftOffset=0|BottomOffset=0|Orientation=2|PaperLength=1000|PaperWidth=1000|Scale=100|PaperSource=7|PrintQuality=-3|MediaType=1|DitherType=10|PrintScaleMode=1|PaperKind=A4|PaperIndex=9
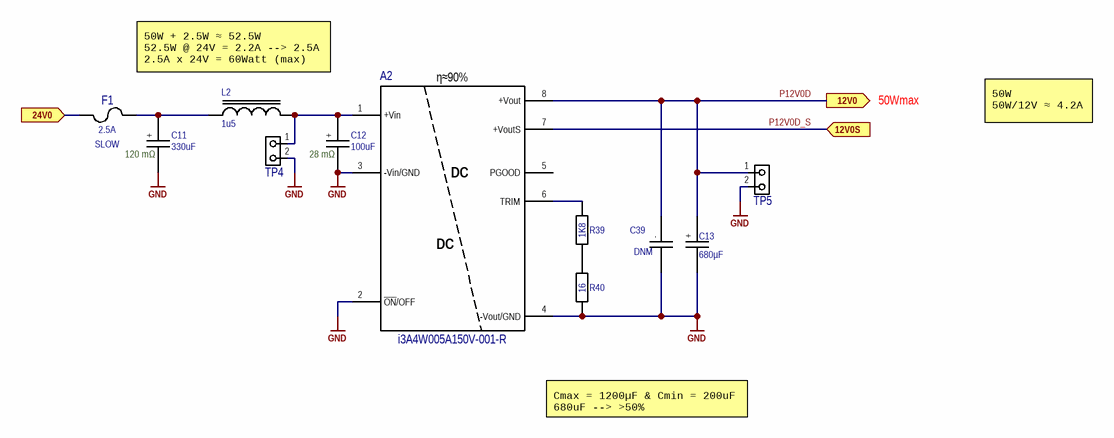
[diagram p2: PSU1.SchDoc]

### Parts
A2  Efficiency: η≈90%  [I3A-POSETIVE]  (hidden comment: A)
C11  value 330uF  ESR: 120 mΩ  [SMD-CAP-ALU-G]  (hidden comment: C+)
C12  value 100uF  ESR: 28 mΩ  [SMD-CAP-ALU-G]  (hidden comment: C+)
C13  value 680µF  [CAP_EL_KE0]  (hidden comment: C+)
C39  value DNM  [C0402 Reflow]  (hidden comment: C)  (no BOM)
F1  value 2.5A  Speed: SLOW  [OMNI-Fuse]  (hidden comment: F)
L2  Inductance: 1u5  [XAL4020]  (hidden comment: L)
R39  value 1K8  [R0603 Reflow]  (hidden comment: R)
R40  value 16  [R0603 Reflow]  (hidden comment: R)
TP4  TP  [DualTestpoint 100mils]  (value not drawn)  (no BOM)
TP5  TP  [DualTestpoint 100mils]  (value not drawn)  (no BOM)

### Ports
12V0 (out), 12V0S (in), 24V0 (in)

### Nets
GND: A2.2(~{ON}/OFF) A2.3(-Vin/GND) A2.4(-Vout/GND) C11.2 C12.2 C13.2 C39.2 R40.1 TP4.2 TP5.2
24V0: F1.1 ; port 24V0
P12V0D: A2.8(+Vout) C13.1 C39.1 TP5.1 ; port 12V0
P12V0D_S: A2.7(+VoutS) ; port 12V0S
NetA2_1: A2.1(+Vin) C12.1 L2.1 TP4.1
NetA2_6: A2.6(TRIM) R39.2
NetC11_1: C11.1 F1.2 L2.2
NetR39_1: R39.1 R40.2

Not connected (* = marked no-connect by the designer): A2 5(PGOOD)

### Notes on the sheet
- 50W + 2.5W ≈ 52.5W
  52.5W @ 24V = 2.2A --> 2.5A
  2.5A x 24V = 60Watt (max)
- 50Wmax
- 50W
  50W/12V ≈ 4.2A
- Cmax = 1200µF & Cmin = 200uF
  680uF --> >50%
- designed by
- reviewed by
- last drawn by
- Project:
- Schematic:
- last printed
- DIN-A4 L
- sheets
- of
- File:
- (in symbol C) .
- (in symbol C+) +
- (in symbol i3A4W005A150V-001-R) DC

### Library data of the parts
A2 = i3A4W005A150V-001-R: DC DC CONVERTER 5-30V 135W; 04. Manufacturer: TDK-Lambda Americas Inc.; 03. Unit Price: 20.18; 13. Created Date/Name: AUG 2018 / Hören; 01. Distributor: Digi-Key; 02. Distributor Part Number: 285-2719-ND; 07. Manufacturer  Part Number: I3A4W005A150V-001-R; ComponentLink1Description: Info; ComponentLink1URL: https://www.digikey.de/products/en/power-supplies-board-mount/dc-dc-converters/922?k=i3A4W005A150V; ComponentLink2Description: DataSheet; ComponentLink2URL: https://www.us.tdk-lambda.com/ftp/specs/i3a_full_datasheet.pdf?ref_disty=digikey; NicName: i3A4W005A150V-001-R
C11 = C+: CAP ALUM 330UF 20% 50V SMD; 04. Manufacturer: Panasonic Electronic Components; 07. Manufacturer  Part Number: EEE-FT1H331AP; 03. Unit Price: 0.96; 13. Created Date/Name: AUG2018/Hören; 3D-Export: No; ComponentLink1Description: Info; ComponentLink1URL: https://www.digikey.de/product-detail/en/panasonic-electronic-components/EEE-FT1H331AP/PCE5026DKR-ND/2652105; Tolerance: ±20%; Voltage Rating: 50V; 02. Distributor Part Number: PCE5026DKR-ND; 09. Operating Temperature: -55°C ~ 105°C; 11. RoHS: YES; 01. Distributor: DigiKey; ComponentLink2Description: DataSheet; ComponentLink2URL: https://industrial.panasonic.com/cdbs/www-data/pdf/RDE0000/ABA0000C1240.pdf
C12 = C+: CAP ALUM POLY HYB 100UF 50V SMD; 04. Manufacturer: Panasonic Electronic Components; 07. Manufacturer  Part Number: EEH-ZA1H101P; Tolerance: ±20%; 03. Unit Price: 2.5; 13. Created Date/Name: AUG2018/Hören; 3D-Export: No; ComponentLink1Description: Info; ComponentLink1URL: https://www.digikey.de/product-detail/en/panasonic-electronic-components/EEH-ZA1H101P/P15442DKR-ND/3088152; Voltage Rating: 50V; 02. Distributor Part Number: P15442DKR-ND; 09. Operating Temperature: -55°C ~ 105°C; 11. RoHS: YES; 01. Distributor: DigiKey; ComponentLink2Description: DataSheet; ComponentLink2URL: https://industrial.panasonic.com/cdbs/www-data/pdf/RDD0000/ABA0000C1221.pdf
C13 = C+: CAP ALUM 680UF 20% 50V SMD; 04. Manufacturer: Panasonic Electronic Components; 07. Manufacturer  Part Number: EEV-FK1V681Q; ESR: 60 mΩ; Voltage Rating: 35V; Type: Radial, Can - SMD; 03. Unit Price: 1.25; Lifetime @ Temp: 5000 Hrs @ 105°C; 3D-Export: No; ComponentLink1Description: Info; ComponentLink1URL: https://www.digikey.de/product-detail/en/panasonic-electronic-components/EEV-FK1H681M/PCE3523DKR-ND/1838505; Tolerance: ±20%; 02. Distributor Part Number: PCE3465CT-ND; 09. Operating Temperature: -55°C ~ 105°C; 11. RoHS: YES; 01. Distributor: DigiKey; ComponentLink2Description: DataSheet; ComponentLink2URL: https://industrial.panasonic.com/cdbs/www-data/pdf/RDE0000/ABA0000C1181.pdf; Package: Ø12.5 mm x 13.5mm
C39 = C: CAP CER 0.1UF 16V X7R 0402; 04. Manufacturer: KEMET; 07. Manufacturer  Part Number: C0402C104J4RACTU; Tolerance: ±5%; 03. Unit Price: 0.45; 13. Created Date/Name: AUG2018/Hören; Voltage Rating: 16V; Type: X7R; ComponentLink1Description: Info; ComponentLink1URL: https://www.digikey.de/product-detail/en/kemet/C0402C104J4RACTU/399-7761-6-ND/3472292; 02. Distributor Part Number: 399-7761-6-ND; 09. Operating Temperature: -55°C ~ 125°C; 11. RoHS: YES; 01. Distributor: DigiKey; ComponentLink2Description: DataSheet; ComponentLink2URL: https://content.kemet.com/datasheets/KEM_C1002_X7R_SMD.pdf; Package: 0402
F1 = Fuse: FUSE BRD MNT 2.5A 125VAC/VDC SMD; 04. Manufacturer: Littelfuse Inc.; 07. Manufacturer  Part Number: 015402.5DRT; 03. Unit Price: 2.75; 13. Created Date/Name: AUG 2018 / Hören; 3D-Export: No; 01. Distributor: DigiKey; 02. Distributor Part Number: F1306DKR-ND; 09. Operating Temperature: -55°C ~ 125°C; 11. RoHS: YES; ComponentLink1Description: Info; ComponentLink1URL: https://www.digikey.de/products/en/circuit-protection/fuses/139?k=&pkeyword=&sv=0&pv7=243&sf=0&FV=ffec3b86%2Cffec4f0c%2Cffec8a72%2Cffec8a73%2Cfffc0012%2C55c00d7%2C1f140000%2Cffe0008b%2Cmu2.5A%7C2088&quantity=&ColumnSort=0&page=1&pageSize=25; ComponentLink2Description: DataSheet; ComponentLink2URL: https://www.littelfuse.com/~/media/electronics/datasheets/fuses/littelfuse_fuse_154_154t_154l_154tl_datasheet.pdf.pdf
L2 = INDUCTOR: Fixed Inductors 1.5uH Shld 20% 7.5A 23.6mOhms AECQ2; 04. Manufacturer: Coilcraft; 07. Manufacturer  Part Number: XAL4020-152MEC; Impedance Tolerance: %; 03. Unit Price: 1.75; ComponentLink1Description: Info; ComponentLink1URL: https://www.digikey.de/products/en?keywords=732-1620-6-ND; ComponentLink2Description: DataSheet; ComponentLink2URL: https://www.we-online.de/katalog/datasheet/742792040.pdf; 02. Distributor Part Number: 994-XAL4020-152MEC; 11. RoHS: YES; Tolerance: *; Value: *; 01. Distributor: Mouser
R39 = R: RES SMD 1.8K OHM 1% 1/16W 0402; 04. Manufacturer: Yageo; 07. Manufacturer  Part Number: RC0402FR-071K8L; 03. Unit Price: 0.09; 13. Created Date/Name: AUG2018/Hören; Power Rating: 200mW; 3D-Export: No; Tolerance: ±1%; ComponentLink1URL: https://www.digikey.de/product-detail/en/panasonic-electronic-components/ERJ-PB3B1801V/P19999DKR-ND/6215726; ComponentLink1Description: Info; 02. Distributor Part Number: 311-1.80KLRCT-ND; 09. Operating Temperature: -55°C ~ 155°C; 11. RoHS: YES; 01. Distributor: DigiKey; ComponentLink2Description: DataSheet; ComponentLink2URL: https://industrial.panasonic.com/cdbs/www-data/pdf/RDM0000/AOA0000C328.pdf; Package: 0603
R40 = R: RES SMD 16 OHM 1% 1/10W 0603; 04. Manufacturer: Yageo; 07. Manufacturer  Part Number: RC0603FR-0716RL; 03. Unit Price: 0.09; 13. Created Date/Name: AUG2018/Hören; Power Rating: 100mW; 3D-Export: No; Tolerance: ±1%; ComponentLink1URL: https://www.digikey.de/product-detail/en/yageo/RC0603FR-0716R2L/311-16.2HRDKR-ND/732860; ComponentLink1Description: Info; 02. Distributor Part Number: 311-16.0HRDKR-ND; 09. Operating Temperature: -55°C ~ 155°C; 11. RoHS: YES; 01. Distributor: DigiKey; ComponentLink2Description: DataSheet; ComponentLink2URL: http://www.yageo.com/documents/recent/PYu-RC_Group_51_RoHS_L_10.pdf; Type: Thick Film; Package: 0603
TP4 TP5 = DualTestpoint 100mils: as TP2 on sheet ADC; 01. Distributor: Samtec Inc.; 02. Distributor Part Number: HMTSW-103-07-G-S-240; 11. RoHS: YES; ComponentLink1Description: Info; ComponentLink1URL: https://www.samtec.com/products/hmtsw-103-07-g-s-240; ComponentLink2Description: DataSheet; ComponentLink2URL: http://suddendocs.samtec.com/catalog_english/hmtsw.pdf